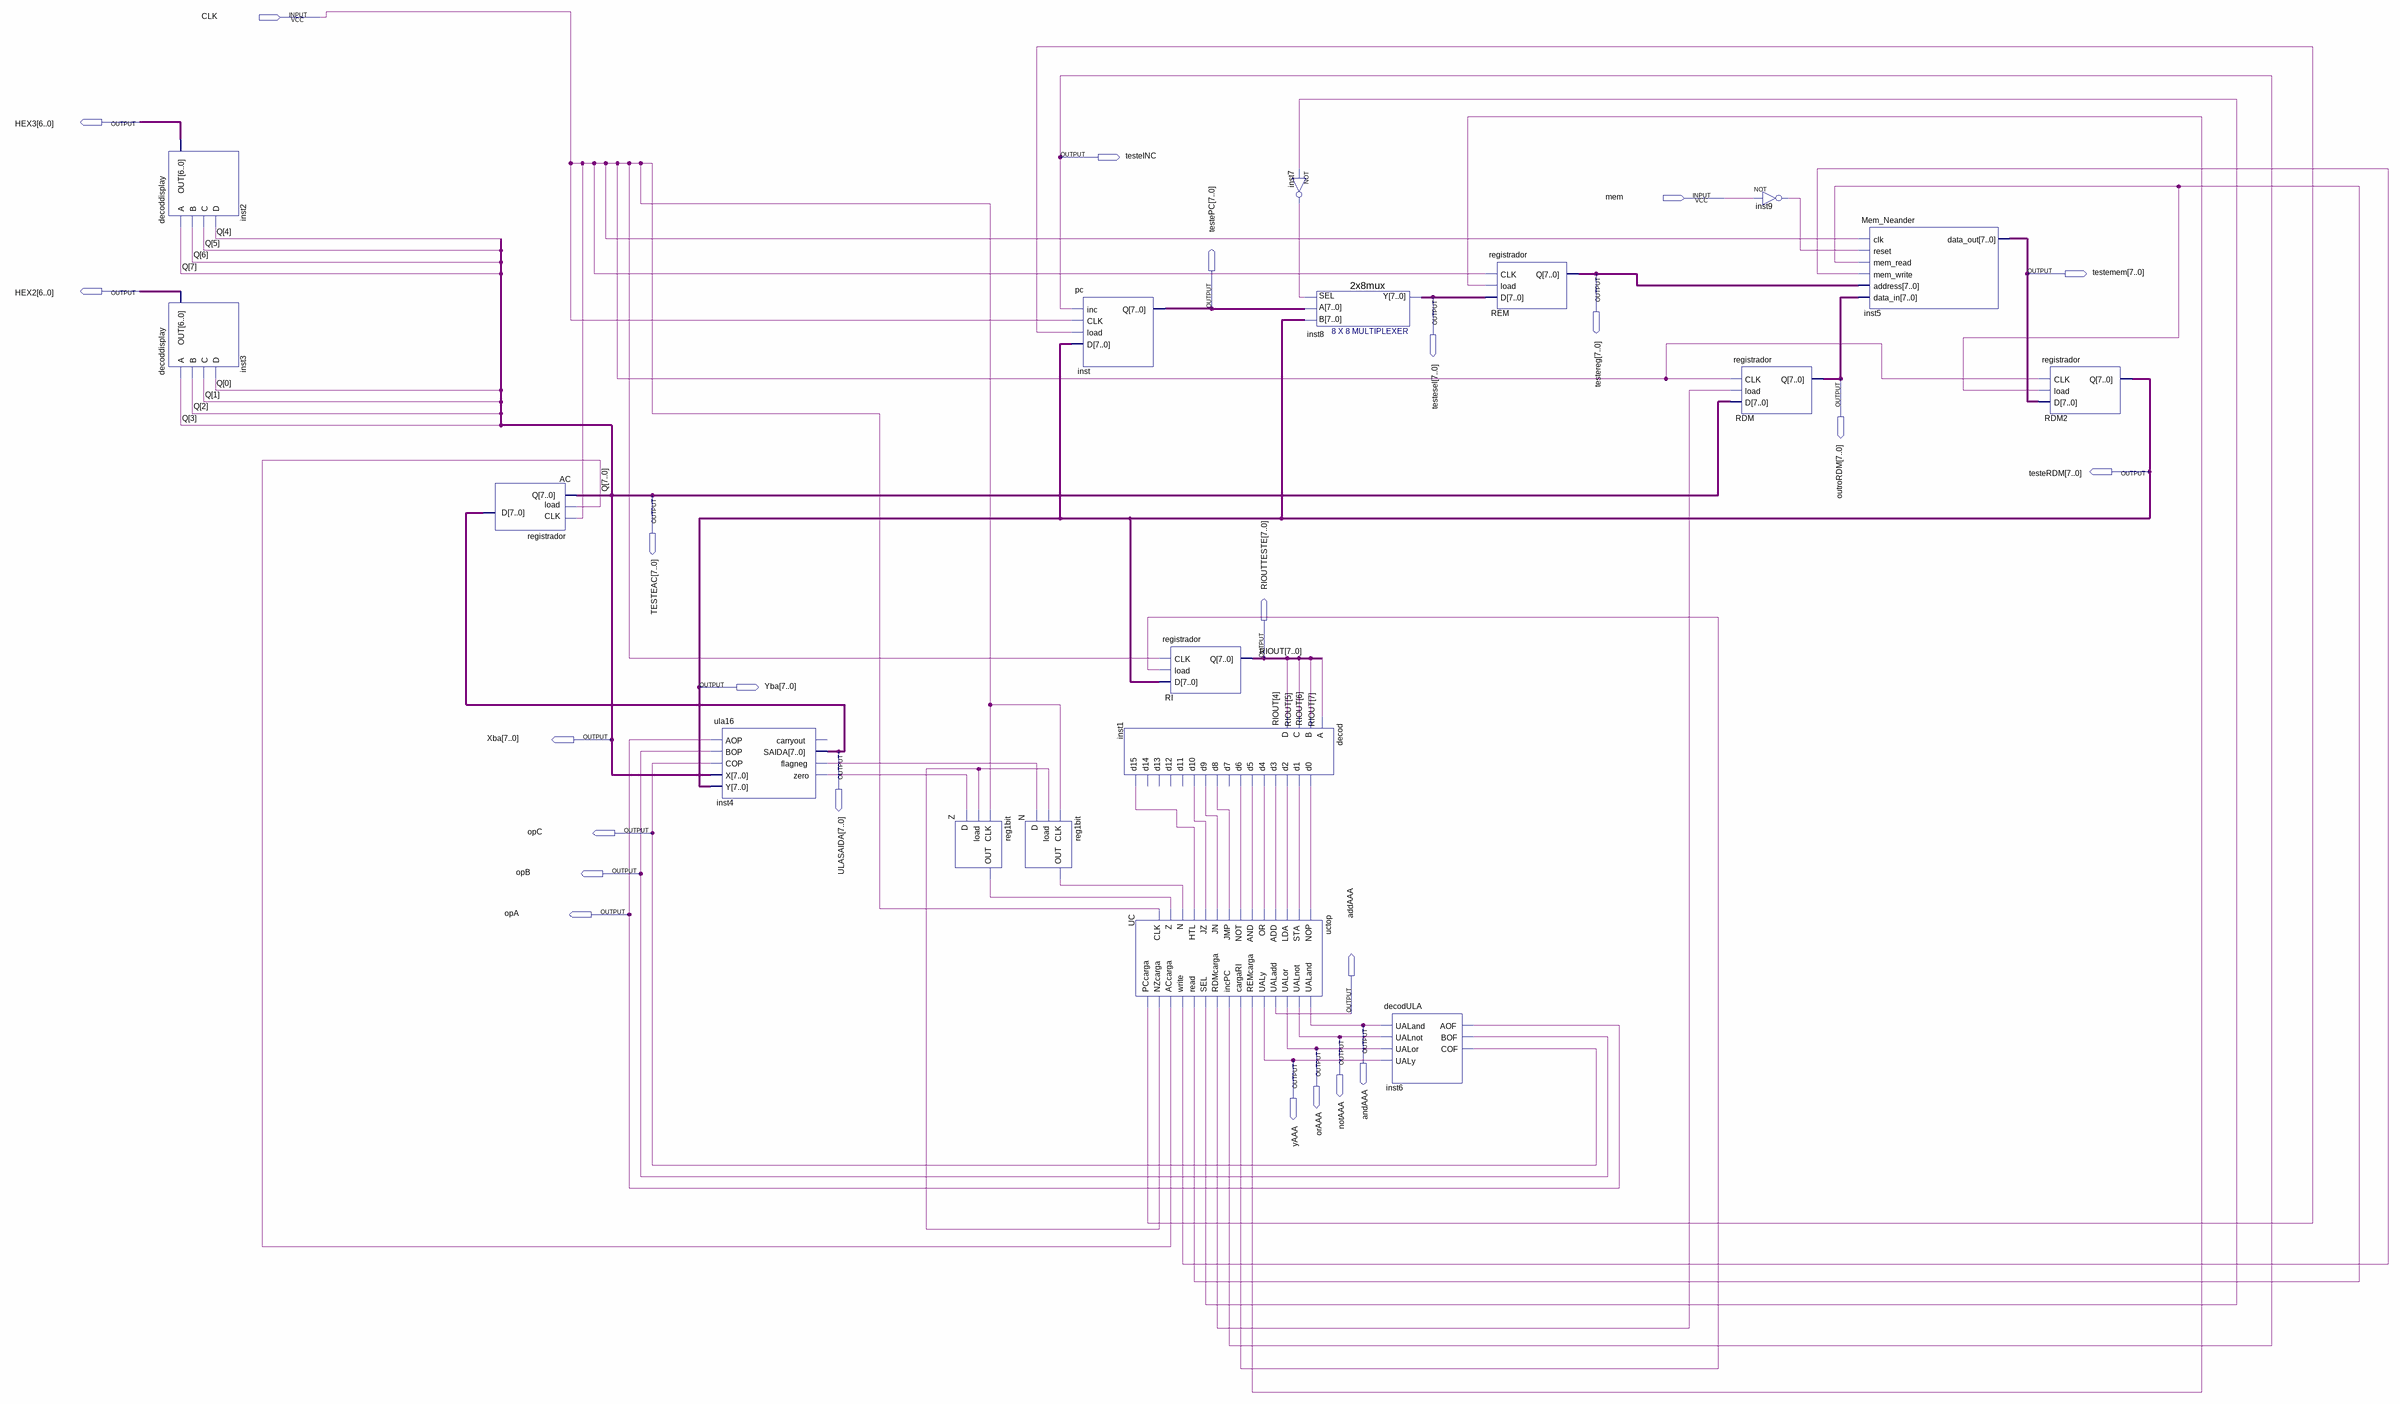
[diagram p0: schematic sheet]
// Quartus schematic NeanderMain.bdf as structural Verilog: 18 symbols, 24 pins
module NeanderMain (
  input  CLK,
  input  mem,
  output [6:0] HEX3,
  output testeINC,
  output [7:0] testereg,
  output [7:0] testemem,
  output [6:0] HEX2,
  output [7:0] testesel,
  output [7:0] testePC,
  output [7:0] outroRDM,
  output [7:0] testeRDM,
  output [7:0] TESTEAC,
  output [7:0] RIOUTTESTE,
  output [7:0] Yba,
  output [7:0] Xba,
  output [7:0] ULASAIDA,
  output opC,
  output opB,
  output opA,
  output addAAA,
  output andAAA,
  output notAAA,
  output orAAA,
  output yAAA
);

  wire inst1_d0, inst1_d1, inst1_d2, inst1_d3, inst1_d4, inst1_d5, inst1_d6, inst1_d8, inst1_d9, inst1_d10,
       inst1_d15, inst4_flagneg, inst4_zero, inst7_out, inst9_out, N_out, UC_accarga, UC_cargari, UC_nzcarga,
       UC_pccarga, UC_rdmcarga, UC_read, UC_remcarga, UC_sel, UC_write, Z_out;

  decoddisplay inst2 (.A(TESTEAC[7]), .B(TESTEAC[6]), .C(TESTEAC[5]), .D(TESTEAC[4]), .OUT(HEX3));
  decoddisplay inst3 (.A(TESTEAC[3]), .B(TESTEAC[2]), .C(TESTEAC[1]), .D(TESTEAC[0]), .OUT(HEX2));
  registrador AC (.CLK(CLK), .load(UC_accarga), .D(ULASAIDA), .Q(TESTEAC));
  ula16 inst4 (
    .AOP(opA), .BOP(opB), .COP(opC), .X(TESTEAC), .Y(testeRDM), .SAIDA(ULASAIDA), .flagneg(inst4_flagneg),
    .zero(inst4_zero));  // open: carryout
  reg1bit Z (.CLK(CLK), .load(UC_nzcarga), .D(inst4_zero), .OUT(Z_out));
  reg1bit N (.CLK(CLK), .load(UC_nzcarga), .D(inst4_flagneg), .OUT(N_out));
  pc inst (.inc(testeINC), .CLK(CLK), .load(UC_pccarga), .D(testeRDM), .Q(testePC));
  decod inst1 (
    .A(RIOUTTESTE[7]), .B(RIOUTTESTE[6]), .C(RIOUTTESTE[5]), .D(RIOUTTESTE[4]), .d15(inst1_d15),
    .d0(inst1_d0), .d1(inst1_d1), .d2(inst1_d2), .d3(inst1_d3), .d4(inst1_d4), .d5(inst1_d5), .d6(inst1_d6),
    .d8(inst1_d8), .d9(inst1_d9), .d10(inst1_d10));  // open: d7, d11, d12, d13, d14
  registrador RI (.CLK(CLK), .load(UC_cargari), .D(testeRDM), .Q(RIOUTTESTE));
  uctop UC (
    .NOP(inst1_d0), .STA(inst1_d1), .LDA(inst1_d2), .ADD(inst1_d3), .OR(inst1_d4), .AND(inst1_d5),
    .NOT(inst1_d6), .JMP(inst1_d8), .JN(inst1_d9), .JZ(inst1_d10), .HTL(inst1_d15), .N(N_out), .Z(Z_out),
    .CLK(CLK), .UALand(andAAA), .UALnot(notAAA), .UALor(orAAA), .UALadd(addAAA), .UALy(yAAA),
    .REMcarga(UC_remcarga), .cargaRI(UC_cargari), .incPC(testeINC), .RDMcarga(UC_rdmcarga), .SEL(UC_sel),
    .read(UC_read), .write(UC_write), .ACcarga(UC_accarga), .NZcarga(UC_nzcarga), .PCcarga(UC_pccarga));
  not inst7 (inst7_out, UC_sel);
  \2x8mux  inst8 (.SEL(inst7_out), .A(testePC), .B(testeRDM), .Y(testesel));
  decodULA inst6 (.UALand(andAAA), .UALnot(notAAA), .UALor(orAAA), .UALy(yAAA), .AOF(opA), .BOF(opB), .COF(opC));
  registrador REM (.CLK(CLK), .load(UC_remcarga), .D(testesel), .Q(testereg));
  not inst9 (inst9_out, mem);
  registrador RDM (.CLK(CLK), .load(UC_rdmcarga), .D(TESTEAC), .Q(outroRDM));
  Mem_Neander inst5 (
    .clk(CLK), .reset(inst9_out), .mem_read(UC_read), .mem_write(UC_write), .address(testereg),
    .data_in(outroRDM), .data_out(testemem));
  registrador RDM2 (.CLK(CLK), .load(UC_read), .D(testemem), .Q(testeRDM));

  assign Xba = TESTEAC;
  assign Yba = testeRDM;

  // Other names for the same wires on the sheet: RIOUT[7:0] = RIOUTTESTE; Q[7:0] = TESTEAC
endmodule
